# Altium project Logicboard_Rev1.PrjPcb (part 2 of 2)

## Sheet Board to Board Connectors.SchDoc: BOARD TO BOARD CONNECTORS
size A3
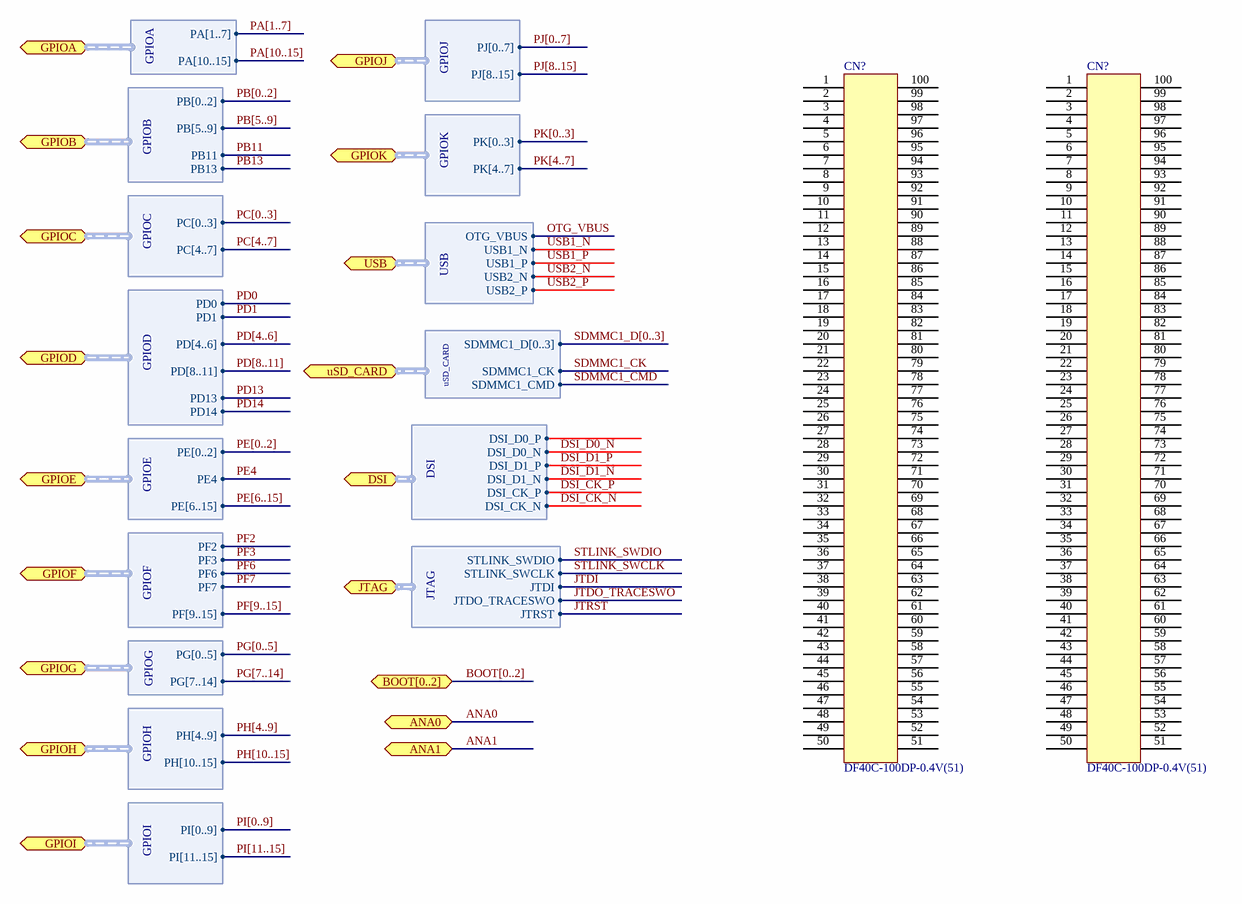
[diagram p8: Board to Board Connectors.SchDoc]

### Parts
(Parts that share a designator on the sheet are numbered #1, #2 ... from top to bottom, then left to right.)
CN?#1  DF40C-100DP-0.4V(51)
CN?#2  DF40C-100DP-0.4V(51)

### Ports
ANA0 (bidir), ANA1 (bidir), BOOT[0..2] (bidir), DSI (bidir, harness DSI), GPIOA (bidir, harness GPIOA), GPIOB (bidir, harness GPIOB), GPIOC (bidir, harness GPIOC), GPIOD (bidir, harness GPIOD), GPIOE (bidir, harness GPIOE), GPIOF (bidir, harness GPIOF), GPIOG (bidir, harness GPIOG), GPIOH (bidir, harness GPIOH), GPIOI (bidir, harness GPIOI), GPIOJ (bidir, harness GPIOJ), GPIOK (bidir, harness GPIOK), JTAG (bidir, harness JTAG), USB (bidir, harness USB), uSD_CARD (bidir, harness uSD_CARD)

### Harnesses
GPIOF: PF2, PF3, PF6, PF7, PF[9..15]
uSD_CARD: SDMMC1_CMD, SDMMC1_D[0..3], SDMMC1_CK
GPIOA: PA[1..7], PA[10..15]
GPIOB: PB[0..2], PB[5..9], PB11, PB13
GPIOD: PD0, PD1, PD[4..6], PD[8..11], PD13, PD14
GPIOE: PE[0..2], PE4, PE[6..15]
GPIOG: PG[0..5], PG[7..14]
GPIOK: PK[0..3], PK[4..7]
GPIOJ: PJ[0..7], PJ[8..15]
GPIOH: PH[4..9], PH[10..15]
GPIOI: PI[0..9], PI[11..15]
GPIOC: PC[0..3], PC[4..7]
DSI: DSI_D0_P, DSI_D0_N, DSI_D1_P, DSI_D1_N, DSI_CK_P, DSI_CK_N
JTAG: STLINK_SWDIO, STLINK_SWCLK, JTDI, JTDO_TRACESWO, JTRST
USB: OTG_VBUS, USB1_N, USB1_P, USB2_N, USB2_P

### Nets

Not connected (* = marked no-connect by the designer): CN?#1 1 2 3 4 5 6 7 8 9 10 11 12 13 14 15 16 17 18 19 20 21 22 23 24 25 26 27 28 29 30 31 32 33 34 35 36 37 38 39 40 41 42 43 44 45 46 47 48 49 50 51 52 53 54 55 56 57 58 59 60 61 62 63 64 65 66 67 68 69 70 71 72 73 74 75 76 77 78 79 80 81 82 83 84 85 86 87 88 89 90 91 92 93 94 95 96 97 98 99 100; CN?#2 1 2 3 4 5 6 7 8 9 10 11 12 13 14 15 16 17 18 19 20 21 22 23 24 25 26 27 28 29 30 31 32 33 34 35 36 37 38 39 40 41 42 43 44 45 46 47 48 49 50 51 52 53 54 55 56 57 58 59 60 61 62 63 64 65 66 67 68 69 70 71 72 73 74 75 76 77 78 79 80 81 82 83 84 85 86 87 88 89 90 91 92 93 94 95 96 97 98 99 100

### Buses and harness runs
bus BOOT[0..2] = port BOOT[0..2]
bus PA[1..7]
bus PA[10..15]
bus PB[0..2]
bus PB[5..9]
bus PC[0..3]
bus PC[4..7]
bus PD[4..6]
bus PD[8..11]
bus PE[0..2]
bus PE[6..15]
bus PF[9..15]
bus PG[0..5]
bus PG[7..14]
bus PH[4..9]
bus PH[10..15]
bus PI[0..9]
bus PI[11..15]
bus PJ[0..7]
bus PJ[8..15]
bus PK[0..3]
bus PK[4..7]
bus SDMMC1_D[0..3]

### Notes on the sheet
- Title
- Size:
- Date:
- A3
- Revision:
- Project Name:
- Sheet:
- of
- Drawn By:
- Checked By:
- www.logicboards.org

### Library data of the parts
CN?#1 CN?#2 = DF40C-100DP-0.4V(51): HIROSE(HRS) - DF40C-100DP-0.4V(51) - Stacking Board Connector, DF40 Series, Header, 0.4 mm, 100, Surface Mount, Gold Plated Contacts RoHS Compliant: Yes; Number of Contacts: 100; Voltage Rating: 30V; Current Rating: 300mA; Contact Resistance: 90mR; Connector Type: Plug; Gender: Male; Pitch: 0.4mm; Stack Height: 1.5mm; Mated Stacking Heights: 4mm; Supplier 1: Mouser; Manufacturer 1: Hirose; Manufacturer Part Number 1: DF40C-100DP-0.4V(51); RoHS: Yes; Category: Headers and Wire Housings; Pricing 1: 1=1.59000, 10=1.33000, 50=1.33000, 100=1.24000, 1000=0.88500, 10000=0.76700 (USD); Mount: Surface Mount; Contact Plating: Gold; Contact Material: Bronze; Housing Color: Black; Housing Material: Polymer; Min Operating Temperature: -35°C; Max Operating Temperature: 85°C; Number of Rows: 2; Termination: SMD/SMT; Package Quantity: 1; Packaging: Tape and Reel; Max Current Rating: 300mA; Number of Positions: 100; Max Voltage Rating (AC): 30V; Orientation: Straight; Series: DF40; Length: 21.52mm; Depth: 1.85mm; Radiation Hardening: No; REACH SVHC: Unknown; Lead Free: Lead Free; RoHS Compliant: Yes; ComponentLink1URL: https://datasheet.ciiva.com/26948/getdatasheetpartid-434445-26948932.pdf?src-supplier=Verical; ComponentLink1Description: https://datasheet.ciiva.com/26948/getdatasheetpartid-434445-26948932.pdf?src-supplier=Verical; ComponentLink2URL: https://datasheet.ciiva.com/46408/1824826-46408893.pdf?src-supplier=Element14; ComponentLink2Description: https://datasheet.ciiva.com/46408/1824826-46408893.pdf?src-supplier=Element14; Supplier 2: Digi-Key; Supplier Part Number 2: H11614CT-ND; Supplier Part Number 1: 798-DF40C100DP0.4V51

## Nets that join several sheets
GND: MPU Power (138 pins), MPU IOs (13 pins), DDR3L Memory (50 pins), Power Management IC (29 pins), eMMC FLASH (19 pins), WLAN and Bluetooth (45 pins)
PMIC_LDO1_1V8: Power Management IC (C?#83.2 U?#9.23), WLAN and Bluetooth (13 pins)
PMIC_LDO4_VDD_USB: MPU Power (C?#34.2 U?#1.AB13 U?#1.AB16), Power Management IC (C?#91.2 U?#9.39)
PMIC_LDO5_2V9: Power Management IC (C?#88.2 U?#9.20), eMMC FLASH (26 pins)
PMIC_VOUT1_VDD_CORE: MPU Power (41 pins), Power Management IC (C?#72.1 L?#1.2 U?#9.5)
PMIC_VOUT2_VDD_DDR: MPU Power (23 pins), DDR3L Memory (29 pins), Power Management IC (5 pins)
PMIC_VOUT3_VDD: MPU Power (19 pins), MPU IOs (6 pins), Power Management IC (C?#76.1 L?#3.2 U?#9.31 U?#9.42)
PMIC_VREF_DDR: MPU IOs (C?#44.1 U?#6.AB19), DDR3L Memory (C?#69.1 C?#70.1 U?#8.H1 U?#8.M8), Power Management IC (C?#80.2 U?#9.16)
BT_DEV_WAKE: MPU IOs (U?#3.H3), WLAN and Bluetooth (U?#11.29)
BT_HOST_WAKE: MPU IOs (U?#4.Y6), WLAN and Bluetooth (U?#11.5)
BT_PCM_CLK: MPU IOs (U?#3.G2), WLAN and Bluetooth (U?#11.85)
BT_PCM_SDI: MPU IOs (U?#3.H5), WLAN and Bluetooth (U?#11.82)
BT_PCM_SDO: MPU IOs (U?#3.K5), WLAN and Bluetooth (U?#11.84)
BT_PCM_WS: MPU IOs (U?#3.F4), WLAN and Bluetooth (U?#11.83)
BT_REG_ON: MPU IOs (U?#3.G3), WLAN and Bluetooth (U?#11.9)
BT_USART3_CTS: MPU IOs (U?#5.W12), WLAN and Bluetooth (U?#11.33)
BT_USART3_CTS: MPU IOs (U?#3.W1), WLAN and Bluetooth (U?#11.34)
BT_USART3_RX: MPU IOs (U?#5.AA7), WLAN and Bluetooth (U?#11.31)
BT_USART3_TX: MPU IOs (U?#5.V9), WLAN and Bluetooth (U?#11.32)
DDR_A0: MPU IOs (U?#6.K19), DDR3L Memory (R?#8.1 U?#7.N3)
DDR_A1: MPU IOs (U?#6.M18), DDR3L Memory (R?#9.1 U?#7.P7)
DDR_A2: MPU IOs (U?#6.J18), DDR3L Memory (R?#10.1 U?#7.P3)
DDR_A3: MPU IOs (U?#6.J19), DDR3L Memory (R?#11.1 U?#7.N2)
DDR_A4: MPU IOs (U?#6.T18), DDR3L Memory (R?#12.1 U?#7.P8)
DDR_A5: MPU IOs (U?#6.H19), DDR3L Memory (R?#13.1 U?#7.P2)
DDR_A6: MPU IOs (U?#6.U19), DDR3L Memory (R?#14.1 U?#7.R8)
DDR_A7: MPU IOs (U?#6.F18), DDR3L Memory (R?#15.1 U?#7.R2)
DDR_A8: MPU IOs (U?#6.U18), DDR3L Memory (R?#16.1 U?#7.T8)
DDR_A9: MPU IOs (U?#6.H18), DDR3L Memory (R?#17.1 U?#7.R3)
DDR_A10: MPU IOs (U?#6.N18), DDR3L Memory (R?#18.1 U?#7.L7)
DDR_A11: MPU IOs (U?#6.P19), DDR3L Memory (R?#19.1 U?#7.R7)
DDR_A12: MPU IOs (U?#6.N19), DDR3L Memory (R?#20.1 U?#7.N7)
DDR_A13: MPU IOs (U?#6.G18), DDR3L Memory (R?#21.1 U?#7.T3)
DDR_A14: MPU IOs (U?#6.P18), DDR3L Memory (R?#22.1 U?#7.T7)
DDR_BA0: MPU IOs (U?#6.K20), DDR3L Memory (R?#23.1 U?#7.M2)
DDR_BA1: MPU IOs (U?#6.R18), DDR3L Memory (R?#24.1 U?#7.N8)
DDR_BA2: MPU IOs (U?#6.K18), DDR3L Memory (R?#25.1 U?#7.M3)
DDR_CASN: MPU IOs (U?#6.M22), DDR3L Memory (R?#27.1 U?#7.K3)
DDR_CKE: MPU IOs (U?#6.R19), DDR3L Memory (R?#29.1 R?#33.1 U?#7.K9)
DDR_CLK_N: MPU IOs (U?#6.N21), DDR3L Memory (R?#34.2 U?#7.K7)
DDR_CLK_P: MPU IOs (U?#6.N20), DDR3L Memory (R?#34.1 U?#7.J7)
DDR_CSN: MPU IOs (U?#6.L18), DDR3L Memory (R?#28.1 U?#7.L2)
DDR_DQ0: MPU IOs (U?#6.E21), DDR3L Memory (U?#7.D7)
DDR_DQ1: MPU IOs (U?#6.F21), DDR3L Memory (U?#7.A7)
DDR_DQ2: MPU IOs (U?#6.H21), DDR3L Memory (U?#7.A3)
DDR_DQ3: MPU IOs (U?#6.E20), DDR3L Memory (U?#7.B8)
DDR_DQ4: MPU IOs (U?#6.J21), DDR3L Memory (U?#7.C2)
DDR_DQ5: MPU IOs (U?#6.H20), DDR3L Memory (U?#7.C3)
DDR_DQ6: MPU IOs (U?#6.H22), DDR3L Memory (U?#7.A2)
DDR_DQ7: MPU IOs (U?#6.G19), DDR3L Memory (U?#7.C8)
DDR_DQ8: MPU IOs (U?#6.N22), DDR3L Memory (U?#7.F2)
DDR_DQ9: MPU IOs (U?#6.R21), DDR3L Memory (U?#7.E3)
DDR_DQ10: MPU IOs (U?#6.P21), DDR3L Memory (U?#7.G2)
DDR_DQ11: MPU IOs (U?#6.T20), DDR3L Memory (U?#7.H7)
DDR_DQ12: MPU IOs (U?#6.V20), DDR3L Memory (U?#7.F7)
DDR_DQ13: MPU IOs (U?#6.R20), DDR3L Memory (U?#7.H3)
DDR_DQ14: MPU IOs (U?#6.U21), DDR3L Memory (U?#7.H8)
DDR_DQ15: MPU IOs (U?#6.V21), DDR3L Memory (U?#7.F8)
DDR_DQM0: MPU IOs (U?#6.G20), DDR3L Memory (U?#7.D3)
DDR_DQM1: MPU IOs (U?#6.T21), DDR3L Memory (U?#7.E7)
DDR_DQS0_N: MPU IOs (U?#6.G21), DDR3L Memory (U?#7.B7)
DDR_DQS0_P: MPU IOs (U?#6.G22), DDR3L Memory (U?#7.C7)
DDR_DQS1_N: MPU IOs (U?#6.R22), DDR3L Memory (U?#7.G3)
DDR_DQS1_P: MPU IOs (U?#6.T22), DDR3L Memory (U?#7.F3)
DDR_ODT: MPU IOs (U?#6.L21), DDR3L Memory (R?#31.1 U?#7.K1)
DDR_RASN: MPU IOs (U?#6.M20), DDR3L Memory (R?#26.1 U?#7.J3)
DDR_RESETN: MPU IOs (U?#6.F19), DDR3L Memory (R?#32.1 U?#7.T2)
DDR_WEN: MPU IOs (U?#6.M21), DDR3L Memory (R?#30.1 U?#7.L3)
I2C4_SCL: MPU IOs (R?#6.1 U?#3.G1), Power Management IC (U?#9.4)
I2C4_SDA: MPU IOs (R?#7.1 U?#3.H4), Power Management IC (U?#9.3)
LPO_32: MPU IOs (U?#4.AB10), WLAN and Bluetooth (U?#11.80)
NRST: MPU IOs (C?#39.2 R?#3.1 U?#3.R2), Power Management IC (U?#9.1), eMMC FLASH (U?#10.K5)
PA0_WKUP: MPU IOs (U?#5.AA3), Power Management IC (U?#9.43)
PMIC_WAKEUP: MPU IOs (U?#5.N2), Power Management IC (U?#9.2)
POWER_ON: MPU IOs (U?#3.V1), Power Management IC (U?#9.44)
SDMMC2_CK: MPU IOs (U?#4.A10), eMMC FLASH (R?#46.2 U?#10.M6)
SDMMC2_CMD: MPU IOs (U?#4.D11), eMMC FLASH (R?#47.2 U?#10.M5)
SDMMC2_D0: MPU IOs (U?#5.A13), eMMC FLASH (R?#38.1 U?#10.A3)
SDMMC2_D1: MPU IOs (U?#5.B12), eMMC FLASH (R?#39.1 U?#10.A4)
SDMMC2_D2: MPU IOs (U?#5.A12), eMMC FLASH (R?#40.1 U?#10.A5)
SDMMC2_D3: MPU IOs (U?#5.C13), eMMC FLASH (R?#41.1 U?#10.B2)
SDMMC2_D4: MPU IOs (U?#5.B13), eMMC FLASH (R?#42.1 U?#10.B3)
SDMMC2_D5: MPU IOs (U?#5.A11), eMMC FLASH (R?#43.1 U?#10.B4)
SDMMC2_D6: MPU IOs (U?#4.C12), eMMC FLASH (R?#44.1 U?#10.B5)
SDMMC2_D7: MPU IOs (U?#5.B11), eMMC FLASH (R?#45.1 U?#10.B6)
SDMMC3_CK: MPU IOs (U?#4.D10), WLAN and Bluetooth (R?#52.2 U?#11.24)
SDMMC3_CMD: MPU IOs (U?#4.B9), WLAN and Bluetooth (R?#50.2 U?#11.26)
SDMMC3_D0: MPU IOs (U?#4.E10), WLAN and Bluetooth (R?#53.2 U?#11.23)
SDMMC3_D1: MPU IOs (U?#4.F9), WLAN and Bluetooth (R?#54.2 U?#11.22)
SDMMC3_D2: MPU IOs (U?#4.D9), WLAN and Bluetooth (R?#55.2 U?#11.21)
SDMMC3_D3: MPU IOs (U?#5.F10), WLAN and Bluetooth (R?#51.2 U?#11.25)
WL_HOST_WAKE: MPU IOs (U?#5.L1), WLAN and Bluetooth (U?#11.7)
WL_REG_ON: MPU IOs (U?#4.AB7), WLAN and Bluetooth (U?#11.10)